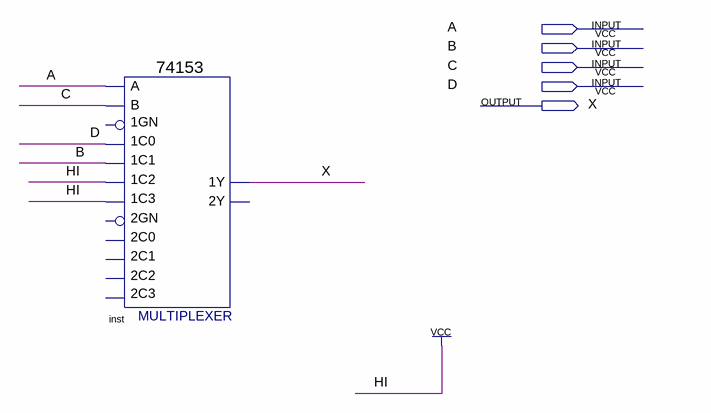
[diagram p0: schematic sheet]
// Quartus schematic Quiz2.bdf as structural Verilog: 1 symbols, 5 pins
module Quiz2 (
  input  A,
  input  B,
  input  C,
  input  D,
  output X
);

  \74153  inst (
    .\1C1 (B), .\1C0 (D), .\1C2 (1'b1), .\1C3 (1'b1), .B(C), .A(A), .\1Y (X));  // open: 1GN, 2C0, 2GN, 2C2, 2C1, 2C3, 2Y
endmodule
